# EAGLE schematic SNESController (EAGLE 6.0)
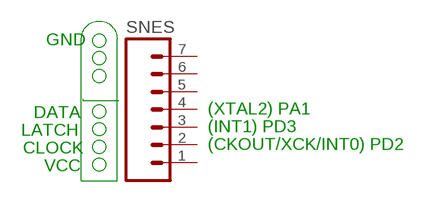
[diagram p0: schematic, sheet 1]

## Parts
SNES  M07  [1X07]
Unconnected: SNES.1 SNES.2 SNES.3 SNES.4 SNES.5 SNES.6 SNES.7

## Notes on the sheet
- GND
- DATA | (XTAL2) PA1
- LATCH | (INT1) PD3
- CLOCK | (CKOUT/XCK/INT0) PD2
- VCC

## Library data of the parts
SNES = SparkFun:M07: Header 7 Standard 7-pin 0.1" header. Use with straight break away headers (SKU : PRT-00116), right angle break away headers (PRT-00553), swiss pins (PRT-00743), machine pins (PRT-00117), and female headers (PRT-00115). NOTES ON THE VARIANTS LOCK and LOCK_LONGPADS... This footprint was designed to help hold the alignment of a through-hole component (i.e. 7-pin header) while soldering it into place. You may notice that each hole has been shifted either up or down by 0.005 of an inch from it's more standard position (which is usually a perfectly straight line). This slight alteration caused the pins (the squares in the middle) to touch the edges of the holes. Because they are alternating, it causes a "brace" to hold the header in place. 0.005 has proven to be the perfect amount of "off-center" position when using our standard breakaway headers. Although looks a little odd when you look at the bare footprint, once you have a header in there, the alteration is very hard to notice. Also, if you push a header all the way into place, it is covered up entirely on the bottom side. This idea of altering the position of holes to aid alignment will be further integrated into the Sparkfun Library for other footprints. It can help hold any component with 3 or more connection pins.